# EasyEDA Pro project Amplifier Module A.eprj

# Schematic Schematic1
Create Date: 2024-02-14; Page Name: P1; Project Name: Amplifier Module A; Schematic Name: Schematic1; Update Date: 2024-02-28; Company: EasyEDA.com; Drawn: EasyEDA; Page Size: A4; Part Number: JLCPCB-002; Reviewed: EasyEDA; Version: V0.1
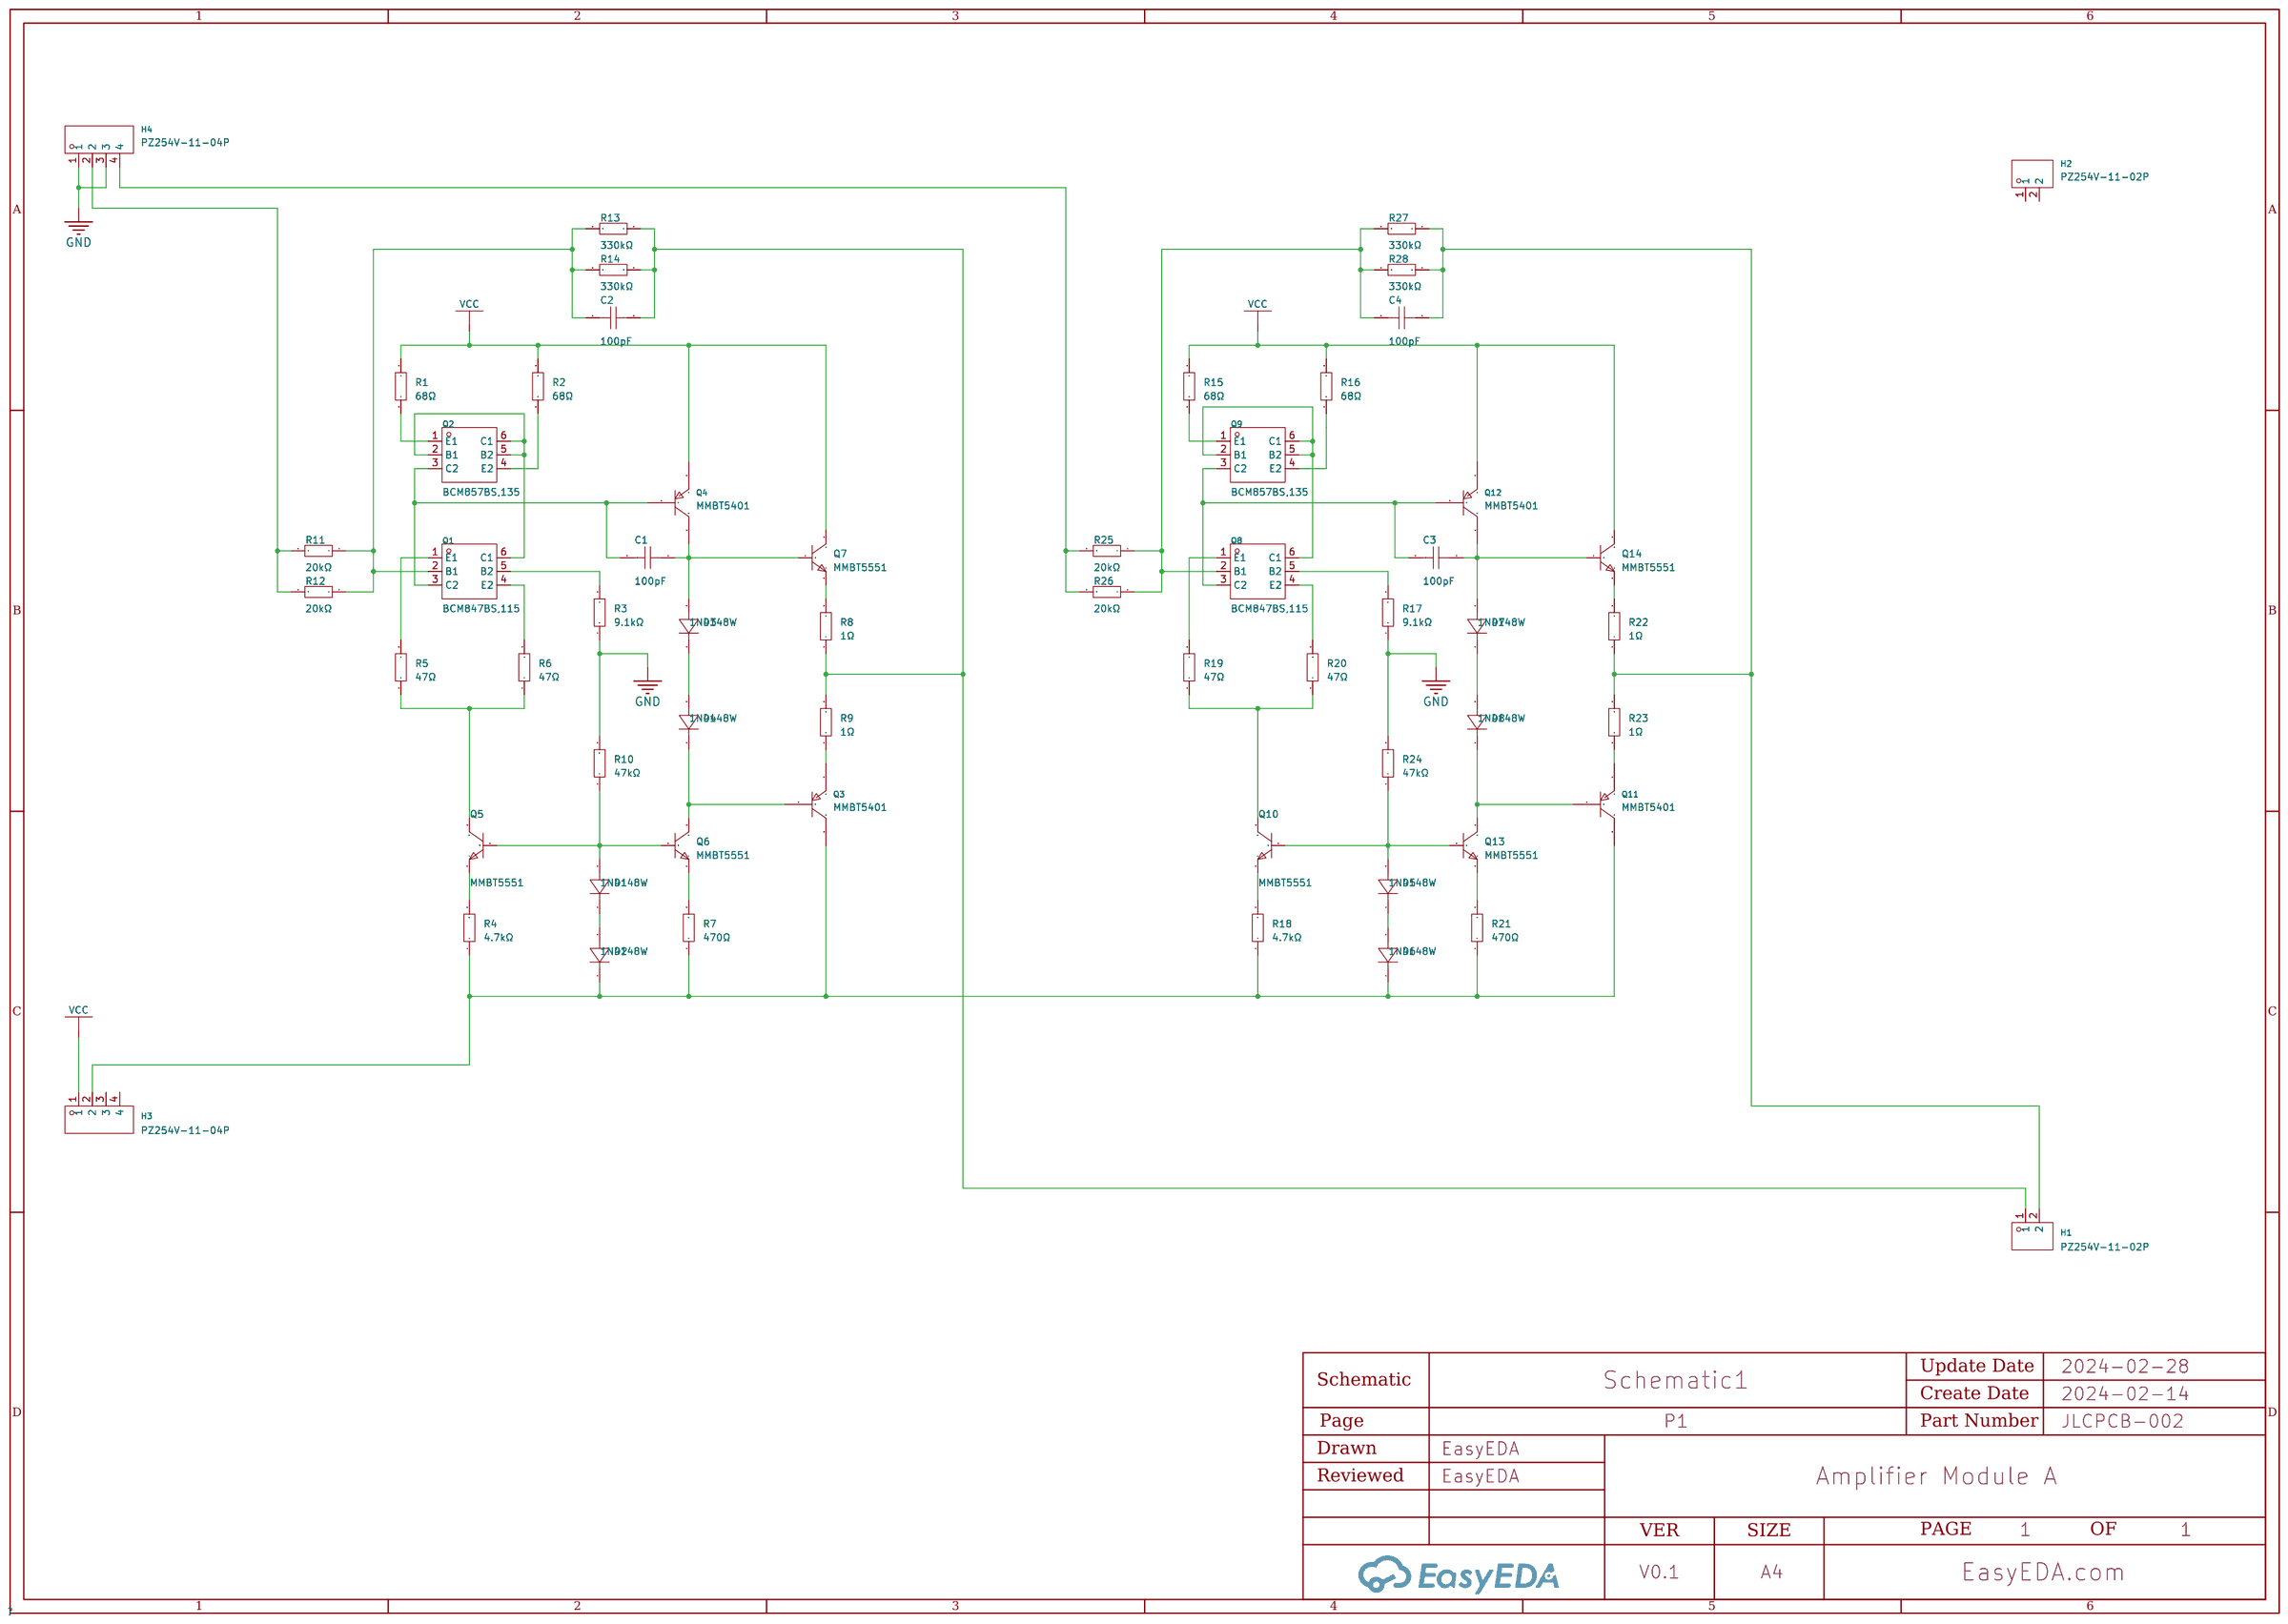
[diagram p0: schematic sheet]

## Parts
C1  100pF  [C0603]
C2  100pF  [C0603]
C3  100pF  [C0603]
C4  100pF  [C0603]
D1  1N4148W  [SOD-123F_L2.7-W1.6-LS3.8-RD]
D2  1N4148W  [SOD-123F_L2.7-W1.6-LS3.8-RD]
D3  1N4148W  [SOD-123F_L2.7-W1.6-LS3.8-RD]
D4  1N4148W  [SOD-123F_L2.7-W1.6-LS3.8-RD]
D5  1N4148W  [SOD-123F_L2.7-W1.6-LS3.8-RD]
D6  1N4148W  [SOD-123F_L2.7-W1.6-LS3.8-RD]
D7  1N4148W  [SOD-123F_L2.7-W1.6-LS3.8-RD]
D8  1N4148W  [SOD-123F_L2.7-W1.6-LS3.8-RD]
H1  PZ254V-11-02P  [HDR-TH_2P-P2.54-V-M]  (no BOM)
H2  PZ254V-11-02P  [HDR-TH_2P-P2.54-V-M]  (no BOM)
H3  PZ254V-11-04P  [HDR-TH_4P-P2.54-V-M]  (no BOM)
H4  PZ254V-11-04P  [HDR-TH_4P-P2.54-V-M]  (no BOM)
Q1  BCM847BS,115  [SOT-363_L2.0-W1.3-P0.65-LS2.1-TL]
Q2  BCM857BS,135  [SOT-363_L2.0-W1.3-P0.65-LS2.1-BL]
Q3  MMBT5401  [SOT-23-3_L2.9-W1.3-P1.90-LS2.4-BR]
Q4  MMBT5401  [SOT-23-3_L2.9-W1.3-P1.90-LS2.4-BR]
Q5  MMBT5551  [SOT-23-3_L2.9-W1.3-P1.90-LS2.4-BR]
Q6  MMBT5551  [SOT-23-3_L2.9-W1.3-P1.90-LS2.4-BR]
Q7  MMBT5551  [SOT-23-3_L2.9-W1.3-P1.90-LS2.4-BR]
Q8  BCM847BS,115  [SOT-363_L2.0-W1.3-P0.65-LS2.1-TL]
Q9  BCM857BS,135  [SOT-363_L2.0-W1.3-P0.65-LS2.1-BL]
Q10  MMBT5551  [SOT-23-3_L2.9-W1.3-P1.90-LS2.4-BR]
Q11  MMBT5401  [SOT-23-3_L2.9-W1.3-P1.90-LS2.4-BR]
Q12  MMBT5401  [SOT-23-3_L2.9-W1.3-P1.90-LS2.4-BR]
Q13  MMBT5551  [SOT-23-3_L2.9-W1.3-P1.90-LS2.4-BR]
Q14  MMBT5551  [SOT-23-3_L2.9-W1.3-P1.90-LS2.4-BR]
R1  68Ω  [R0603]
R2  68Ω  [R0603]
R3  9.1kΩ  [R0603]
R4  4.7kΩ  [R0603]
R5  47Ω  [R0603]
R6  47Ω  [R0603]
R7  470Ω  [R0603]
R8  1Ω  [R0603]
R9  1Ω  [R0603]
R10  47kΩ  [R0603]
R11  20kΩ  [R0603]
R12  20kΩ  [R0603]
R13  330kΩ  [R0603]
R14  330kΩ  [R0603]
R15  68Ω  [R0603]
R16  68Ω  [R0603]
R17  9.1kΩ  [R0603]
R18  4.7kΩ  [R0603]
R19  47Ω  [R0603]
R20  47Ω  [R0603]
R21  470Ω  [R0603]
R22  1Ω  [R0603]
R23  1Ω  [R0603]
R24  47kΩ  [R0603]
R25  20kΩ  [R0603]
R26  20kΩ  [R0603]
R27  330kΩ  [R0603]
R28  330kΩ  [R0603]

## Library data of the parts
C1-C4 = 0603CG101J101NT: Capacitance: Tolerance:±5% Tolerance:±5% Voltage Rated: Temperature Coefficient:; LCSC Part Name: 100pF ±5% 100V; Supplier Part: C44567; Manufacturer: FH(风华); Supplier Footprint: 0603; JLCPCB Part Class: Extended Part; Datasheet: https://atta.szlcsc.com/upload/public/pdf/source/20200305/C486355_26A10D38EF8C2A5C37091D0039909270.pdf; Supplier: LCSC; Tolerance: ±5%
D1-D8 = 1N4148W_C81598: Diode Configuration: Forward Voltage (Vf@If):1V@50mA Reverse Voltage (Vr): Average Rectified Current (Io): Power Dissipation: Reverse Leakage Current:1uA@75V Reverse Recovery Time (trr): Operating Temperature:- Operating Temperature:-; LCSC Part Name: 电压:75V 电流:150mA; Supplier Part: C81598; Manufacturer: ST(先科); Supplier Footprint: SOD-123; JLCPCB Part Class: Basic Part; Datasheet: https://atta.szlcsc.com/upload/public/pdf/source/20161024/1477288446905.pdf; Supplier: LCSC; Forward Voltage (Vf@If): 1V@50mA; Reverse Leakage Current: 1uA@75V
H1 H2 = PZ254V-11-02P: Pin Structure:1x2P Pitch:2.54mm Row Spacing:- Circluar Pins/Square Pins:Square Pins Mounting Type:Straight Number of Rows:Plugin Number of Pins:2P Current Rating (Max):- Voltage Rating (Max):- Length of Mating Pin:6mm Insulation Height:2.5mm Length of End; LCSC Part Name: 间距:2.54mm 1x2P 直插 方针; Supplier Part: C492401; Manufacturer: XFCN(兴飞); Supplier Footprint: 插件,P=2.54mm; JLCPCB Part Class: Extended Part; Datasheet: https://atta.szlcsc.com/upload/public/pdf/source/20200309/C492401_A812433581A9B211A7FFA413ADDFF0E5.pdf; Supplier: LCSC; Pin Structure: 1x2P; Pitch: 2.54mm; Circluar Pins/Square Pins: Square Pins; Mounting Type: Straight; Number of Rows: Plugin; Number of Pins: 2P; Length of Mating Pin: 6mm; Insulation Height: 2.5mm; Length of End Connection Pin: 3mm; Operating Temperature Range: -40℃~+105℃; Color: Black
H3 H4 = PZ254V-11-04P: Pin Structure:1x4P Pitch:2.54mm Row Spacing:- Circluar Pins/Square Pins:Square Pins Mounting Type:Straight Number of Rows:Plugin Number of Pins:4P Current Rating (Max):3A Voltage Rating (Max):250V Length of Mating Pin:6mm Insulation Height:2.5mm Length of; LCSC Part Name: 间距:2.54mm 1x4P 直插 方针; Supplier Part: C2691448; Manufacturer: XFCN(兴飞); Supplier Footprint: 插件,P=2.54mm; JLCPCB Part Class: Extended Part; Datasheet: https://atta.szlcsc.com/upload/public/pdf/source/20200309/C492403_F9F19131791D08044AD4F84F8E751A34.pdf; Supplier: LCSC; Pin Structure: 1x4P; Pitch: 2.54mm; Circluar Pins/Square Pins: Square Pins; Mounting Type: Straight; Number of Rows: Plugin; Number of Pins: 4P; Current Rating (Max): 3A; Voltage Rating (Max): 250V; Length of Mating Pin: 6mm; Insulation Height: 2.5mm; Length of End Connection Pin: 3mm; Operating Temperature Range: -40℃~+105℃; Color: Black
Q1 Q8 = BCM847BS,115: Transistor Type:2 NPN Collector Current (Ic): Collector-Emitter Breakdown Voltage (Vceo): Power Dissipation (Pd): DC Current Gain (hFE@Ic,Vce):200@2mA,5V DC Current Gain (hFE@Ic,Vce):200@2mA,5V Transition Frequency (fT):250MHz Collector Cut-Off Current (I; LCSC Part Name: 耐压:45V 电流:100mA 2个NPN; Supplier Part: C396099; Manufacturer: Nexperia(安世); Supplier Footprint: SOT-363; JLCPCB Part Class: Extended Part; Datasheet: https://atta.szlcsc.com/upload/public/pdf/source/20191121/C458178_4EE31D3B148B127A6331BB364C0F8B2D.pdf; Supplier: LCSC; Transistor Type: 2 NPN; DC Current Gain (hFE@Ic,Vce): 200@2mA,5V; Transition Frequency (fT): 250MHz; Collector Cut-Off Current (Icbo): 15nA; Collector-Emitter Saturation Voltage (VCE(sat)@Ic,Ib): 400mV@5mA,100mA
Q2 Q9 = BCM857BS,135: Transistor Type: Collector Current (Ic): Collector-Emitter Breakdown Voltage (Vceo): Power Dissipation (Pd): DC Current Gain (hFE@Ic,Vce):200@2mA,5V DC Current Gain (hFE@Ic,Vce):200@2mA,5V Transition Frequency (fT):175MHz Collector Cut-Off Current (Icbo):; LCSC Part Name: 2个PNP 电流:100mA 耐压:45V; Supplier Part: C503385; Manufacturer: Nexperia(安世); Supplier Footprint: SOT-363; JLCPCB Part Class: Extended Part; Datasheet: https://atta.szlcsc.com/upload/public/pdf/source/20200107/C105887_86E9989A2C6D7BFD107FE0D2C6B1BB93.pdf; Supplier: LCSC; DC Current Gain (hFE@Ic,Vce): 200@2mA,5V; Transition Frequency (fT): 175MHz; Collector Cut-Off Current (Icbo): 15nA; Collector-Emitter Saturation Voltage (VCE(sat)@Ic,Ib): 200mV@100mA,5mA
Q3 Q4 Q11 Q12 = MMBT5401_C8326: Transistor Type: Collector Current (Ic): Collector-Emitter Breakdown Voltage (Vceo): Power Dissipation (Pd): DC Current Gain (hFE@Ic,Vce):200@10mA,5V DC Current Gain (hFE@Ic,Vce):200@10mA,5V Transition Frequency (fT):100MHz Collector Cut-Off Current (Icbo; LCSC Part Name: PNP 电流:600mA 耐压:150V hfe=200~300; Supplier Part: C8326; Manufacturer: CJ(江苏长电/长晶); Supplier Footprint: SOT-23; JLCPCB Part Class: Basic Part; Datasheet: https://atta.szlcsc.com/upload/public/pdf/source/20140809/1457707213644.pdf; Supplier: LCSC; DC Current Gain (hFE@Ic,Vce): 200@10mA,5V; Transition Frequency (fT): 100MHz; Collector Cut-Off Current (Icbo): 100nA; Collector-Emitter Saturation Voltage (VCE(sat)@Ic,Ib): 500mV@50mA,5mA
Q5-Q7 Q10 Q13 Q14 = MMBT5551_C2145: Transistor Type: Collector Current (Ic): Collector-Emitter Breakdown Voltage (Vceo): Power Dissipation (Pd): DC Current Gain (hFE@Ic,Vce):200@10mA,5V DC Current Gain (hFE@Ic,Vce):200@10mA,5V Transition Frequency (fT):100MHz Collector Cut-Off Current (Icbo; LCSC Part Name: NPN 电流:600mA 耐压:160V hfe=200~300; Supplier Part: C2145; Manufacturer: CJ(江苏长电/长晶); Supplier Footprint: SOT-23; JLCPCB Part Class: Basic Part; Datasheet: https://atta.szlcsc.com/upload/public/pdf/source/20140321/1457707027001.pdf; Supplier: LCSC; DC Current Gain (hFE@Ic,Vce): 200@10mA,5V; Transition Frequency (fT): 100MHz; Collector Cut-Off Current (Icbo): 50nA; Collector-Emitter Saturation Voltage (VCE(sat)@Ic,Ib): 200mV@50mA,5mA
R1 R2 R15 R16 = 0603WAF680JT5E: Type:Thick Film Resistors Resistance:68Ω Tolerance:±1% Tolerance:±1% Power(Watts): Overload Voltage (Max): Temperature Coefficient:±100ppm/℃ Temperature Coefficient:±100ppm/℃ Operating Temperature Range:-55℃~+155℃ Operating Temperature Range:-55℃~+155℃; LCSC Part Name: 68Ω ±1% 100mW 厚膜电阻; Supplier Part: C27592; Manufacturer: UNI-ROYAL(厚声); Supplier Footprint: 0603; JLCPCB Part Class: Extended Part; Datasheet: https://atta.szlcsc.com/upload/public/pdf/source/20200306/C422600_1E6D84923E4A46A82E41ADD87F860B5C.pdf; Supplier: LCSC; Type: Thick Film Resistors; Tolerance: ±1%; Temperature Coefficient: ±100ppm/℃; Operating Temperature Range: -55℃~+155℃
R3 R17 = 0603WAF9101T5E: Type:Thick Film Resistors Resistance:9.1kΩ Tolerance:±1% Tolerance:±1% Power(Watts): Overload Voltage (Max): Temperature Coefficient:±100ppm/℃ Temperature Coefficient:±100ppm/℃ Operating Temperature Range:-55℃~+155℃ Operating Temperature Range:-55℃~+155℃; LCSC Part Name: 9.1kΩ ±1% 100mW 厚膜电阻; Supplier Part: C23260; Manufacturer: UNI-ROYAL(厚声); Supplier Footprint: 0603; JLCPCB Part Class: Basic Part; Datasheet: https://atta.szlcsc.com/upload/public/pdf/source/20200306/C422600_1E6D84923E4A46A82E41ADD87F860B5C.pdf; Supplier: LCSC; Type: Thick Film Resistors; Tolerance: ±1%; Temperature Coefficient: ±100ppm/℃; Operating Temperature Range: -55℃~+155℃
R4 R18 = 0603WAF4701T5E: Type:Thick Film Resistors Resistance:4.7kΩ Tolerance:±1% Tolerance:±1% Power(Watts): Overload Voltage (Max): Temperature Coefficient:±100ppm/℃ Temperature Coefficient:±100ppm/℃ Operating Temperature Range:-55℃~+155℃ Operating Temperature Range:-55℃~+155℃; LCSC Part Name: 4.7kΩ ±1% 100mW 厚膜电阻; Supplier Part: C23162; Manufacturer: UNI-ROYAL(厚声); Supplier Footprint: 0603; JLCPCB Part Class: Basic Part; Datasheet: https://atta.szlcsc.com/upload/public/pdf/source/20200306/C422600_1E6D84923E4A46A82E41ADD87F860B5C.pdf; Supplier: LCSC; Type: Thick Film Resistors; Tolerance: ±1%; Temperature Coefficient: ±100ppm/℃; Operating Temperature Range: -55℃~+155℃
R5 R6 R19 R20 = 0603WAF470JT5E: Type:Thick Film Resistors Resistance:47Ω Tolerance:±1% Tolerance:±1% Power(Watts): Overload Voltage (Max): Temperature Coefficient:±100ppm/℃ Temperature Coefficient:±100ppm/℃ Operating Temperature Range:-55℃~+155℃ Operating Temperature Range:-55℃~+155℃; LCSC Part Name: 47Ω ±1% 100mW 厚膜电阻; Supplier Part: C23182; Manufacturer: UNI-ROYAL(厚声); Supplier Footprint: 0603; JLCPCB Part Class: Basic Part; Datasheet: https://atta.szlcsc.com/upload/public/pdf/source/20200306/C422600_1E6D84923E4A46A82E41ADD87F860B5C.pdf; Supplier: LCSC; Type: Thick Film Resistors; Tolerance: ±1%; Temperature Coefficient: ±100ppm/℃; Operating Temperature Range: -55℃~+155℃
R7 R21 = 0603WAF4700T5E: Type:Thick Film Resistors Resistance: Tolerance:±1% Tolerance:±1% Power(Watts): Overload Voltage (Max): Temperature Coefficient:±100ppm/℃ Temperature Coefficient:±100ppm/℃ Operating Temperature Range:-55℃~+155℃ Operating Temperature Range:-55℃~+155℃; LCSC Part Name: 470Ω ±1% 100mW 厚膜电阻; Supplier Part: C23179; Manufacturer: UNI-ROYAL(厚声); Supplier Footprint: 0603; JLCPCB Part Class: Basic Part; Datasheet: https://atta.szlcsc.com/upload/public/pdf/source/20200306/C422600_1E6D84923E4A46A82E41ADD87F860B5C.pdf; Supplier: LCSC; Type: Thick Film Resistors; Tolerance: ±1%; Temperature Coefficient: ±100ppm/℃; Operating Temperature Range: -55℃~+155℃
R8 R9 R22 R23 = 0603WAF100KT5E: Type:Thick Film Resistors Resistance:1Ω Tolerance:±1% Tolerance:±1% Power(Watts): Overload Voltage (Max): Temperature Coefficient:±400ppm/℃ Temperature Coefficient:±400ppm/℃ Operating Temperature Range:-55℃~+155℃ Operating Temperature Range:-55℃~+155℃; LCSC Part Name: 1Ω ±1% 100mW 厚膜电阻; Supplier Part: C22936; Manufacturer: UNI-ROYAL(厚声); Supplier Footprint: 0603; JLCPCB Part Class: Basic Part; Datasheet: https://atta.szlcsc.com/upload/public/pdf/source/20200306/C422600_1E6D84923E4A46A82E41ADD87F860B5C.pdf; Supplier: LCSC; Type: Thick Film Resistors; Tolerance: ±1%; Temperature Coefficient: ±400ppm/℃; Operating Temperature Range: -55℃~+155℃
R10 R24 = 0603WAF4702T5E: Type:Thick Film Resistors Resistance:47kΩ Tolerance:±1% Tolerance:±1% Power(Watts): Overload Voltage (Max): Temperature Coefficient:±100ppm/℃ Temperature Coefficient:±100ppm/℃ Operating Temperature Range:-55℃~+155℃ Operating Temperature Range:-55℃~+155℃; LCSC Part Name: 47kΩ ±1% 100mW 厚膜电阻; Supplier Part: C25819; Manufacturer: UNI-ROYAL(厚声); Supplier Footprint: 0603; JLCPCB Part Class: Basic Part; Datasheet: https://atta.szlcsc.com/upload/public/pdf/source/20200306/C422600_1E6D84923E4A46A82E41ADD87F860B5C.pdf; Supplier: LCSC; Type: Thick Film Resistors; Tolerance: ±1%; Temperature Coefficient: ±100ppm/℃; Operating Temperature Range: -55℃~+155℃
R11 R12 R25 R26 = 0603WAF2002T5E: Type:Thick Film Resistors Resistance:20kΩ Tolerance:±1% Tolerance:±1% Power(Watts): Overload Voltage (Max): Temperature Coefficient:±100ppm/℃ Temperature Coefficient:±100ppm/℃ Operating Temperature Range:-55℃~+155℃ Operating Temperature Range:-55℃~+155℃; LCSC Part Name: 20kΩ ±1% 100mW 厚膜电阻; Supplier Part: C4184; Manufacturer: UNI-ROYAL(厚声); Supplier Footprint: 0603; JLCPCB Part Class: Basic Part; Datasheet: https://atta.szlcsc.com/upload/public/pdf/source/20200306/C422600_1E6D84923E4A46A82E41ADD87F860B5C.pdf; Supplier: LCSC; Type: Thick Film Resistors; Tolerance: ±1%; Temperature Coefficient: ±100ppm/℃; Operating Temperature Range: -55℃~+155℃
R13 R14 R27 R28 = 0603WAF3303T5E: Type:Thick Film Resistors Resistance:330kΩ Tolerance:±1% Tolerance:±1% Power(Watts): Overload Voltage (Max): Temperature Coefficient:±100ppm/℃ Temperature Coefficient:±100ppm/℃ Operating Temperature Range:-55℃~+155℃ Operating Temperature Range:-55℃~+155℃; LCSC Part Name: 330kΩ ±1% 100mW 厚膜电阻; Supplier Part: C23137; Manufacturer: UNI-ROYAL(厚声); Supplier Footprint: 0603; JLCPCB Part Class: Basic Part; Datasheet: https://atta.szlcsc.com/upload/public/pdf/source/20200306/C422600_1E6D84923E4A46A82E41ADD87F860B5C.pdf; Supplier: LCSC; Type: Thick Film Resistors; Tolerance: ±1%; Temperature Coefficient: ±100ppm/℃; Operating Temperature Range: -55℃~+155℃

## Nets
GND: H4.1 H4.3 R3.1 R10.2 R17.1 R24.2
VCC: H3.1 Q4.2(E) Q7.3(C) Q12.2(E) Q14.3(C) R1.2 R2.2 R15.2 R16.2
$1N352: Q1.5(B2) R3.2
$1N392: Q2.1(E1) R1.1
$1N396: Q2.4(E2) R2.1
$1N943: D3.1(K) D4.2(A)
$1N952: Q5.2(E) R4.2
$1N965: D1.1(K) D2.2(A)
$1N1213: Q7.2(E) R8.2
$1N1219: Q6.2(E) R7.2
$1N1261: Q5.3(C) R5.1 R6.1
$1N1268: Q1.4(E2) R6.2
$1N1272: Q1.1(E1) R5.2
$1N1306: D1.2(A) Q5.1(B) Q6.1(B) R10.1
$1N1603: C2.2 Q1.2(B1) R11.1 R12.1 R13.2 R14.2
$1N4259: H4.2 R11.2 R12.2
$1N6262: Q8.5(B2) R17.2
$1N6263: Q9.1(E1) R15.1
$1N6264: Q9.4(E2) R16.1
$1N6267: D7.1(K) D8.2(A)
$1N6268: Q10.2(E) R18.2
$1N6269: D5.1(K) D6.2(A)
$1N6270: Q14.2(E) R22.2
$1N6271: Q11.2(E) R23.1
$1N6272: Q13.2(E) R21.2
$1N6273: Q10.3(C) R19.1 R20.1
$1N6274: Q8.4(E2) R20.2
$1N6275: Q8.1(E1) R19.2
$1N6276: D5.2(A) Q10.1(B) Q13.1(B) R24.1
$1N6277: C4.2 Q8.2(B1) R25.1 R26.1 R27.2 R28.2
$1N6278: D8.1(K) Q11.1(B) Q13.3(C)
$1N6279: C3.1 D7.2(A) Q12.3(C) Q14.1(B)
$1N6352: C2.1 H1.1 R8.1 R9.2 R13.1 R14.1
$1N6394: H4.4 R25.2 R26.2
$1N6410: C4.1 H1.2 R22.1 R23.2 R27.1 R28.1
$1N11327: Q3.2(E) R9.1
$1N11333: D4.1(K) Q3.1(B) Q6.3(C)
$1N11343: D2.1(K) D6.1(K) H3.2 Q3.3(C) Q11.3(C) R4.1 R7.1 R18.1 R21.1
$1N11425: C1.1 D3.2(A) Q4.3(C) Q7.1(B)
$1N15038: Q8.6(C1) Q9.2(B1) Q9.5(B2) Q9.6(C1)
$1N15063: C3.2 Q8.3(C2) Q9.3(C2) Q12.1(B)
$1N15103: C1.2 Q1.3(C2) Q2.3(C2) Q4.1(B)
$1N15131: Q1.6(C1) Q2.2(B1) Q2.5(B2) Q2.6(C1)

Not connected (* = marked no-connect by the designer): H2 1 2; H3 3 4

# Board PCB1
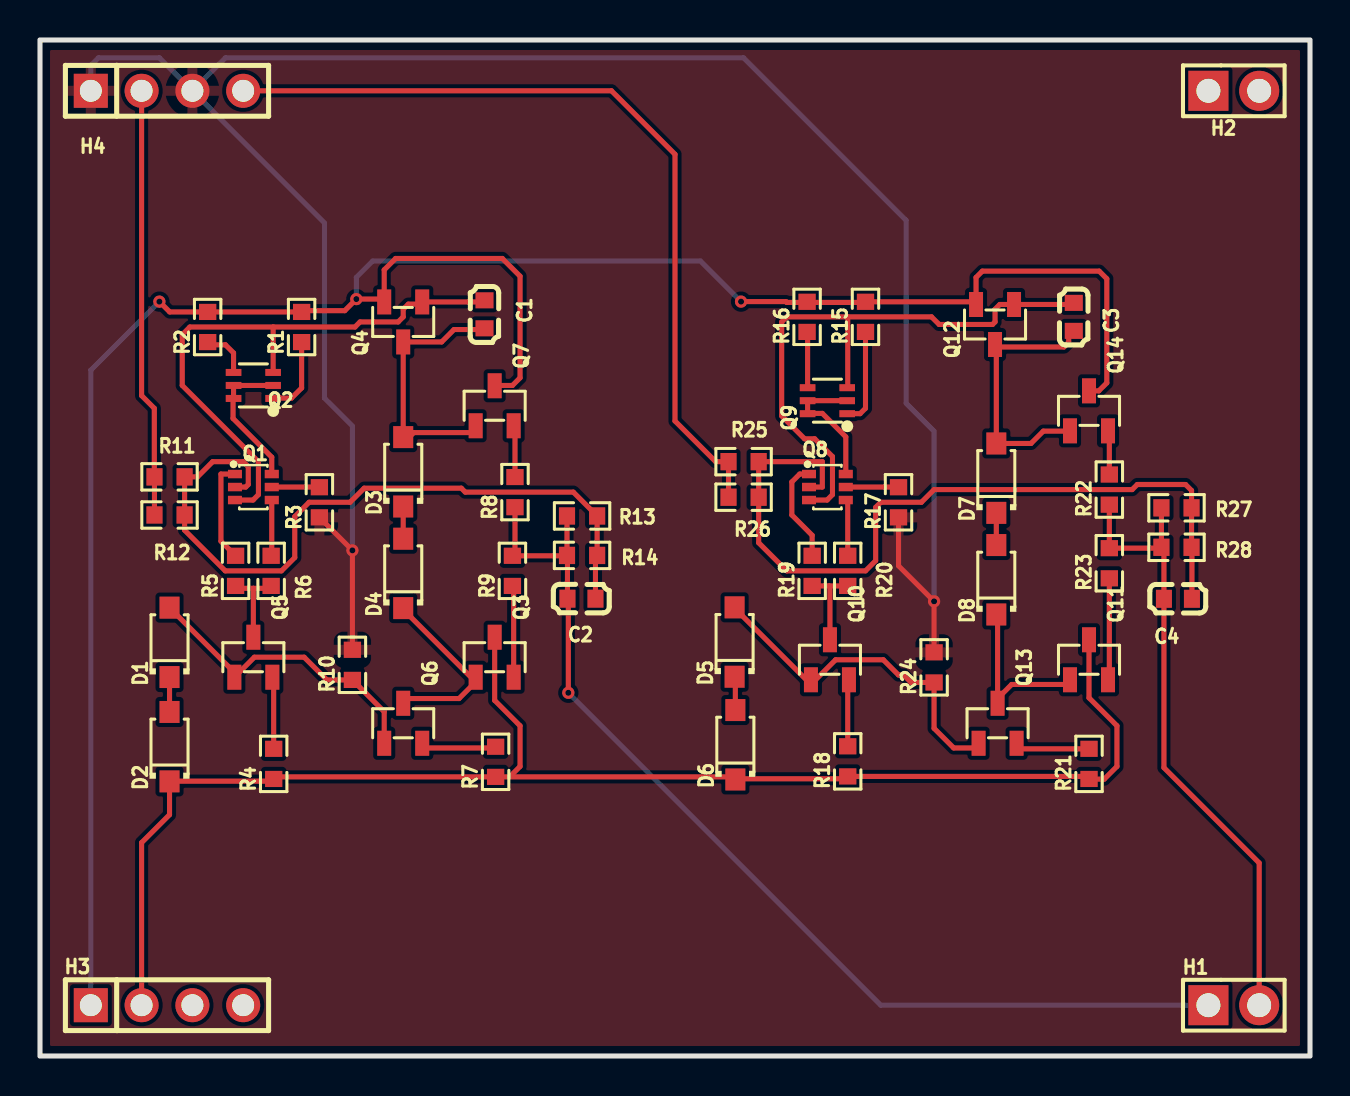
[diagram p1: board, top side]
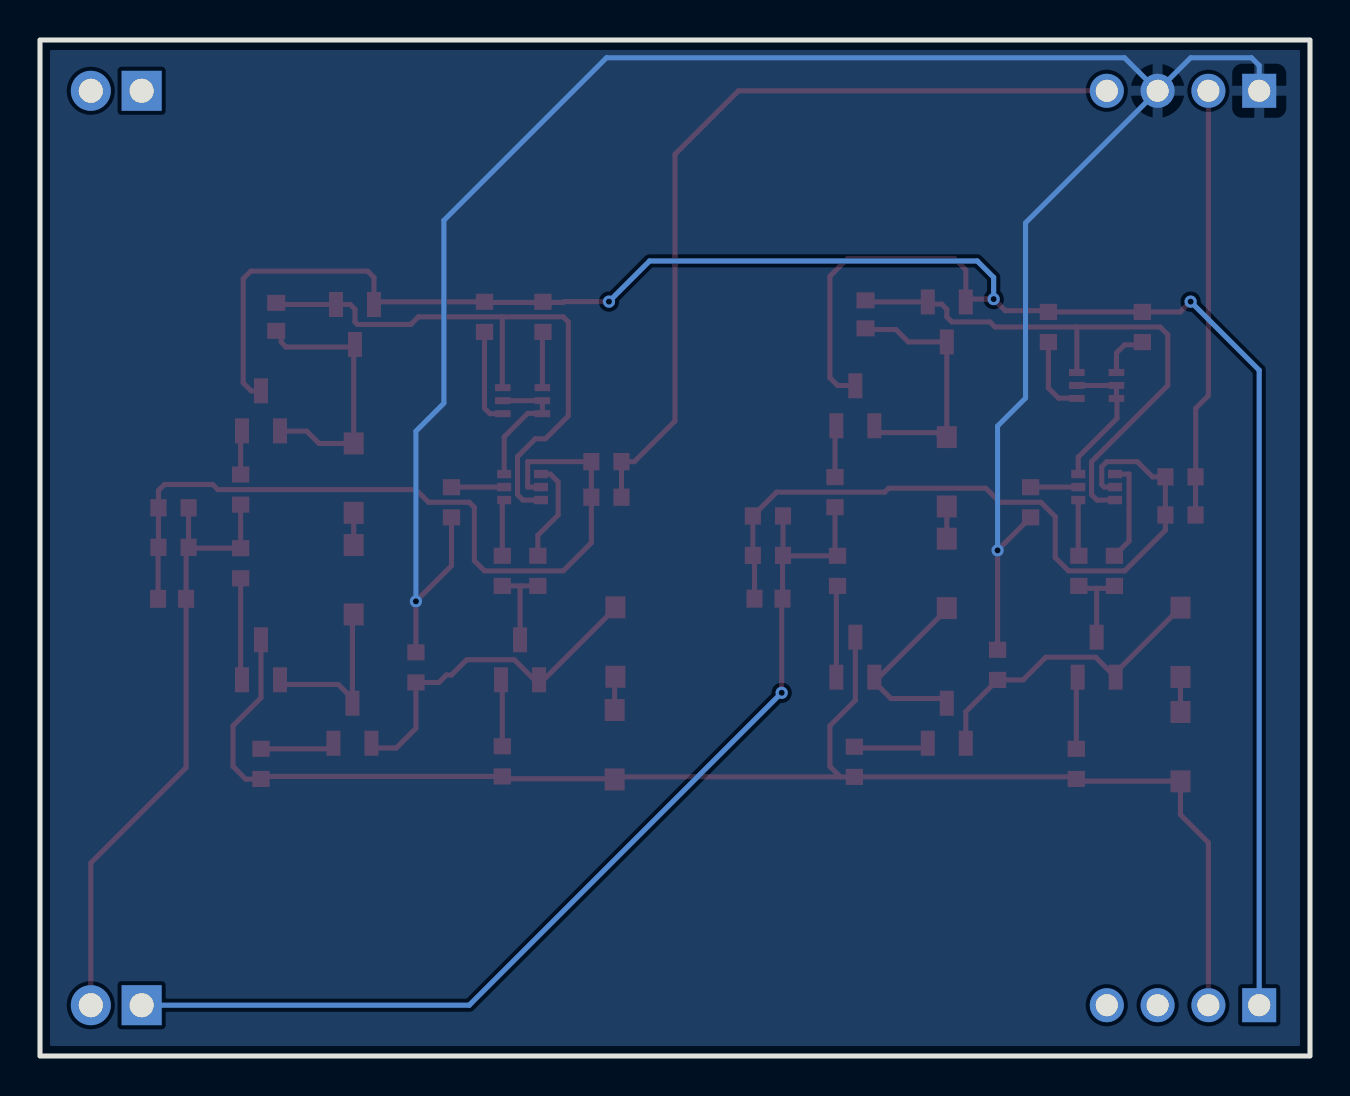
[diagram p2: board, bottom side, seen from below]

Outline 63.5 x 50.8 mm; copper layers: Top Layer, Bottom Layer. Coordinates in mm from the lower left corner of the outline.
Outline path: rectangle 0,50.8 63.5,0
Stack: Top Layer 0.035mm / Dielectric1 1.51mm FR4 er 4.5 / Bottom Layer 0.035mm

## Design rules (mm)
template: JLCPCB Capability(Two Layers Board)
spacing copperThickness1oz (default): track to track 0.102, other pairs 0.152 to 0.3
spacing copperThickness2oz: track to track 0.203, other pairs 0.152 to 0.3
track width copperThickness1oz (default): min 0.127, default 0.254, max 2.54
track width copperThickness2oz: min 0.203, default 0.254, max 2.54
differential pair differentialPair (default): width min 0.127, default 0.254, max 2.54; gap min 0.152, default 0.152
via viaSize (default): diameter min 0.5, default 0.61, max 10; hole min 0.3, default 0.305, max 6.3

## Placement (name value [footprint] x y rotation side)
C1  100pF  [C0603]  22.22 37.08 90 top
C2  100pF  [C0603]  27.07 22.87 0 top
C3  100pF  [C0603]  51.69 36.96 90 top
C4  100pF  [C0603]  56.9 22.86 0 top
D1  1N4148W  [SOD-123F_L2.7-W1.6-LS3.8-RD]  6.48 20.68 90 top
D2  1N4148W  [SOD-123F_L2.7-W1.6-LS3.8-RD]  6.48 15.47 90 top
D3  1N4148W  [SOD-123F_L2.7-W1.6-LS3.8-RD]  18.16 29.21 90 top
D4  1N4148W  [SOD-123F_L2.7-W1.6-LS3.8-RD]  18.16 24.13 90 top
D5  1N4148W  [SOD-123F_L2.7-W1.6-LS3.8-RD]  34.73 20.7 90 top
D6  1N4148W  [SOD-123F_L2.7-W1.6-LS3.8-RD]  34.77 15.56 90 top
D7  1N4148W  [SOD-123F_L2.7-W1.6-LS3.8-RD]  47.82 28.89 90 top
D8  1N4148W  [SOD-123F_L2.7-W1.6-LS3.8-RD]  47.82 23.81 90 top
H1  PZ254V-11-02P  [HDR-TH_2P-P2.54-V-M]  59.69 2.54 0 top
H2  PZ254V-11-02P  [HDR-TH_2P-P2.54-V-M]  59.69 48.26 0 top
H3  PZ254V-11-04P  [HDR-TH_4P-P2.54-V-M]  6.35 2.54 0 top
H4  PZ254V-11-04P  [HDR-TH_4P-P2.54-V-M]  6.35 48.26 0 top
Q1  BCM847BS,115  [SOT-363_L2.0-W1.3-P0.65-LS2.1-TL]  10.67 28.45 0 top
Q2  BCM857BS,135  [SOT-363_L2.0-W1.3-P0.65-LS2.1-BL]  10.67 33.53 90 top
Q3  MMBT5401  [SOT-23-3_L2.9-W1.3-P1.90-LS2.4-BR]  22.73 19.94 270 top
Q4  MMBT5401  [SOT-23-3_L2.9-W1.3-P1.90-LS2.4-BR]  18.16 36.7 90 top
Q5  MMBT5551  [SOT-23-3_L2.9-W1.3-P1.90-LS2.4-BR]  10.67 19.94 270 top
Q6  MMBT5551  [SOT-23-3_L2.9-W1.3-P1.90-LS2.4-BR]  18.16 16.64 270 top
Q7  MMBT5551  [SOT-23-3_L2.9-W1.3-P1.90-LS2.4-BR]  22.73 32.51 270 top
Q8  BCM847BS,115  [SOT-363_L2.0-W1.3-P0.65-LS2.1-TL]  39.37 28.45 0 top
Q9  BCM857BS,135  [SOT-363_L2.0-W1.3-P0.65-LS2.1-BL]  39.37 32.77 90 top
Q10  MMBT5551  [SOT-23-3_L2.9-W1.3-P1.90-LS2.4-BR]  39.5 19.81 270 top
Q11  MMBT5401  [SOT-23-3_L2.9-W1.3-P1.90-LS2.4-BR]  52.45 19.81 270 top
Q12  MMBT5401  [SOT-23-3_L2.9-W1.3-P1.90-LS2.4-BR]  47.75 36.58 90 top
Q13  MMBT5551  [SOT-23-3_L2.9-W1.3-P1.90-LS2.4-BR]  47.88 16.64 270 top
Q14  MMBT5551  [SOT-23-3_L2.9-W1.3-P1.90-LS2.4-BR]  52.45 32.26 270 top
R1  68Ω  [R0603]  13.08 36.45 90 top
R2  68Ω  [R0603]  8.38 36.45 90 top
R3  9.1kΩ  [R0603]  13.97 27.69 90 top
R4  4.7kΩ  [R0603]  11.68 14.61 90 top
R5  47Ω  [R0603]  9.78 24.26 90 top
R6  47Ω  [R0603]  11.56 24.26 90 top
R7  470Ω  [R0603]  22.78 14.71 90 top
R8  1Ω  [R0603]  23.75 28.19 90 top
R9  1Ω  [R0603]  23.62 24.26 90 top
R10  47kΩ  [R0603]  15.62 19.56 90 top
R11  20kΩ  [R0603]  6.48 28.96 180 top
R12  20kΩ  [R0603]  6.48 27.05 180 top
R13  330kΩ  [R0603]  27.1 27 0 top
R14  330kΩ  [R0603]  27.1 25.03 0 top
R15  68Ω  [R0603]  41.28 36.96 90 top
R16  68Ω  [R0603]  38.35 36.96 90 top
R17  9.1kΩ  [R0603]  42.93 27.69 90 top
R18  4.7kΩ  [R0603]  40.39 14.73 90 top
R19  47Ω  [R0603]  38.61 24.26 90 top
R20  47Ω  [R0603]  40.39 24.26 90 top
R21  470Ω  [R0603]  52.45 14.61 90 top
R22  1Ω  [R0603]  53.47 28.32 90 top
R23  1Ω  [R0603]  53.47 24.64 90 top
R24  47kΩ  [R0603]  44.7 19.43 90 top
R25  20kΩ  [R0603]  35.18 29.72 180 top
R26  20kΩ  [R0603]  35.18 27.94 180 top
R27  330kΩ  [R0603]  56.82 27.41 0 top
R28  330kΩ  [R0603]  56.82 25.44 0 top

## Footprints (pads in the part's own frame, mm; a bottom-side part is the same pattern mirrored in y, then rotated)
C0603
  rect 0.8x0.9 smd: 1(-0.7,0) 2(0.7,0)
HDR-TH_2P-P2.54-V-M
  rect 2x2 hole 1.2: 1(-1.27,0)
  round 2 hole 1.2: 2(1.27,0)
HDR-TH_4P-P2.54-V-M
  rect 1.7x1.7 hole 1.1: 1(-3.81,0)
  round 1.7 hole 1.1: 2(-1.27,0) 3(1.27,0) 4(3.81,0)
R0603
  rect 0.806x0.864 smd: 1(-0.753,0) 2(0.753,0)
SOD-123F_L2.7-W1.6-LS3.8-RD
  rect 1.1x1 smd: 1(-1.735,0) 2(1.735,0)
SOT-23-3_L2.9-W1.3-P1.90-LS2.4-BR
  rect 1.25x0.7 smd: 1(1,-0.95) 2(1,0.95) 3(-1,0)
SOT-363_L2.0-W1.3-P0.65-LS2.1-BL
  rect 0.35x0.78 smd: 1(-0.65,-0.99) 2(0,-0.99) 3(0.65,-0.99) 4(0.65,0.99) 5(0,0.99) 6(-0.65,0.99)
SOT-363_L2.0-W1.3-P0.65-LS2.1-TL
  rect 0.7x0.42 smd: 1(-0.92,0.65) 2(-0.92,0) 3(-0.92,-0.65) 4(0.92,-0.65) 5(0.92,0) 6(0.92,0.65)

## Nets
As in the schematic.

Pads without a net: H2 1 2; H3 3 4

## Via types
v1: diameter 0.61, hole 0.305, Top Layer to Bottom Layer, 6 vias

## Routing (per net, layer and track width the routed paths; a pad name or vN(x,y) marks a point on that pad's centre or on a via; arc(x,y) is an arc through that point)
GND: length 107.6
  Top Layer w0.254: R24.2 v1(44.7,22.73) 42.93,24.51 R17.1 ; R3.1 v1(15.62,25.28) R10.2
  Bottom Layer w0.254: v1(44.7,22.73) 44.7,31.24 43.31,32.64 43.31,41.78 35.18,49.91 9.27,49.91 H4.3 ; H4.1 2.54,49.53 2.92,49.91 5.97,49.91 H4.3 ; H4.3 14.22,41.66 14.22,32.89 15.62,31.5 v1(15.62,25.28)
VCC: length 111.7
  Top Layer w0.254: Q7.3 22.75,33.53 23.62,33.53 24,33.91 24,38.99 23.11,39.88 17.78,39.88 17.21,39.31 Q4.2 17.07,37.85 v1(15.82,37.85) 15.24,37.27 13.08,37.27 13.02,37.2 R2.2 6.49,37.2 v1(5.97,37.72) ; v1(35.05,37.72) 37.3,37.72 37.34,37.68 41.24,37.68 R15.2 46.67,37.71 Q12.2 46.8,38.93 47.12,39.24 52.96,39.24 53.34,38.86 53.34,33.66 52.94,33.26 Q14.3
  Bottom Layer w0.254: H3.1 2.54,34.29 v1(5.97,37.72) ; v1(15.82,37.85) 15.82,38.93 16.64,39.75 33.02,39.75 v1(35.05,37.72)
$1N352: length 2.4
  Top Layer w0.254: R3.2 13.96,28.45 Q1.5
$1N392: length 4
  Top Layer w0.254: 13.08,35.76 13.08,33.4 12.57,32.89 11.67,32.89 Q2.1
$1N396: length 2.5
  Top Layer w0.254: Q2.4 9.68,35.15 9.27,35.56 8.52,35.56 R2.1
$1N943: length 1.7
  Top Layer w0.254: 18.16,27.51 18.16,25.83
$1N952: length 3.4
  Top Layer w0.254: 11.62,18.7 11.68,18.64 R4.2
$1N965: length 1.8
  Top Layer w0.254: 6.48,18.98 6.48,17.17
$1N1213: length 2.4
  Top Layer w0.254: 23.68,31.28 23.75,31.21 R8.2
$1N1219: length 3.7
  Top Layer w0.254: 19.11,15.4 22.72,15.4 22.78,15.46
$1N1261: length 4.1
  Top Layer w0.254: 10.67,23.38 11.44,23.38 R6.1 ; 10.67,23.38 9.9,23.38 R5.1 ; 10.67,23.38 10.67,21.17
$1N1268: length 2.8
  Top Layer w0.254: R6.2 11.59,25.04 Q1.4
$1N1272: length 5.1
  Top Layer w0.254: R5.2 9.05,25.74 9.05,29.1 Q1.1
$1N1306: length 15.7
  Top Layer w0.254: D1.2 9.72,19.18 Q5.1 10.72,19.94 13.21,19.94 14.34,18.8 R10.1 17.21,17.21 17.21,15.4
$1N1603: length 37.1
  Top Layer w0.254: Q1.2 10.29,28.45 10.41,28.58 10.41,29.46 10.16,29.72 8.64,29.72 7.87,28.96 R11.1 7.2,28.96 7.23,28.93 R12.1 7.23,26.29 9.26,24.26 12.07,24.26 12.74,24.92 12.74,26.97 13.46,27.69 15.5,27.69 16.21,28.39 21.07,28.39 21.26,28.19 26.66,28.19 R13.2 ; R13.2 27.8,26.95 ; R13.2 R14.2 27.77,24.94 C2.2
$1N4259: length 21.5
  Top Layer w0.254: R12.2 R11.2 5.72,28.96 5.72,32.39 5.08,33.02 H4.2
$1N6262: length 2.6
  Top Layer w0.254: Q8.5 42.92,28.45 R17.2
$1N6263: length 4.8
  Top Layer w0.254: R15.1 41.28,32.39 41.01,32.12 Q9.1
$1N6264: length 2.8
  Top Layer w0.254: R16.1 38.38,36.18 Q9.4
$1N6267: length 1.7
  Top Layer w0.254: 47.82,25.51 47.82,27.19
$1N6268: length 3.1
  Top Layer w0.254: R18.2 40.39,18.52 40.45,18.58
$1N6269: length 1.8
  Top Layer w0.254: 34.77,17.26 34.77,18.96 34.73,19
$1N6270: length 2
  Top Layer w0.254: 53.4,31.02 53.47,30.96 R22.2
$1N6271: length 5.3
  Top Layer w0.254: 53.4,18.58 53.47,18.64 R23.1
$1N6272: length 3.6
  Top Layer w0.254: 48.83,15.4 48.87,15.36 R21.2
$1N6273: length 4.3
  Top Layer w0.254: R20.1 39.45,23.5 ; 39.45,23.5 R19.1 ; 39.45,23.5 39.5,23.46 39.5,21.05
$1N6274: length 2.8
  Top Layer w0.254: R20.2 40.39,27.7 Q8.4
$1N6275: length 5.1
  Top Layer w0.254: Q8.1 37.99,29.1 37.59,28.7 37.59,27.05 38.61,26.03 R19.2
$1N6276: length 17.5
  Top Layer w0.254: 34.73,22.4 34.73,22.39 38.55,18.58 39.78,19.81 42.16,19.81 42.93,19.05 43.18,19.05 43.55,18.68 R24.1 44.7,16.38 45.69,15.4 46.93,15.4
$1N6277: length 40.3
  Top Layer w0.254: C4.2 57.6,25.42 R28.2 R27.2 57.58,28.27 57.28,28.58 54.86,28.58 54.61,28.32 44.7,28.32 44.07,27.69 42.04,27.69 41.78,27.43 41.78,24.77 41.28,24.26 37.34,24.26 35.93,25.66 R26.1 R25.1 39.12,29.72 39.12,28.45 Q8.2
$1N6278: length 8.2
  Top Layer w0.254: 47.82,22.11 47.88,22.05 47.88,17.87 48.58,18.58 51.5,18.58
$1N6279: length 13.1
  Top Layer w0.254: 47.82,35.45 51.2,35.45 51.44,35.69 51.44,36.26 ; 47.82,35.45 47.75,35.45 ; 47.82,35.45 D7.2 49.55,30.63 50.16,31.24 51.49,31.24 Q14.1
$1N6352: length 52.5
  Top Layer w0.254: 23.75,25.01 R9.2 ; 23.75,25.01 R8.1 ; 23.75,25.01 26.33,25.01 R14.1 ; v1(26.42,18.16) 26.42,22.82 26.37,22.87 26.37,25.01 R14.1 ; R14.1 R13.1
  Bottom Layer w0.254: v1(26.42,18.16) 42.04,2.54 H1.1
$1N6394: length 41.5
  Top Layer w0.254: R26.2 R25.2 33.78,29.72 31.75,31.75 31.75,45.08 28.57,48.26 H4.4
$1N6410: length 31.7
  Top Layer w0.254: R28.1 56.03,25.39 R23.2 R22.1 ; R28.1 56.2,25.31 C4.1 56.2,14.42 60.96,9.65 H1.2 ; R28.1 R27.1
$1N11327: length 4.8
  Top Layer w0.254: R9.1 23.68,23.44 23.68,18.7
$1N11333: length 9.2
  Top Layer w0.254: 18.16,17.87 20.95,17.87 21.78,18.7 18.16,22.33 18.16,22.43
$1N11343: length 74.9
  Top Layer w0.254: H3.2 5.08,10.67 6.48,12.06 6.48,13.77 6.5,13.74 11.68,13.74 R4.1 11.79,13.96 R7.1 23.48,13.96 ; 23.48,13.96 34.67,13.96 34.77,13.86 40.27,13.86 R18.1 52.32,13.98 R21.1 52.46,13.84 53.21,13.84 53.85,14.48 53.85,16.51 52.45,17.91 52.45,21.05 ; 23.48,13.96 24,14.48 24,16.51 22.73,17.78 22.73,21.17
$1N11425: length 12.9
  Top Layer w0.254: D3.2 Q4.3 20.08,35.7 20.7,36.32 22.16,36.32 C1.1 ; 18.16,30.91 18.43,30.91 18.69,31.17 21.68,31.17 21.78,31.28
$1N15038: length 6.9
  Top Layer w0.254: Q9.2 Q9.5 Q9.6 38.4,32.13 39.12,32.13 40.29,30.96 Q8.6
$1N15063: length 30.5
  Top Layer w0.254: 40.39,36.96 37.34,36.96 37.08,36.7 37.08,32 38.23,30.86 38.74,30.86 39.62,29.97 39.62,28.07 39.35,27.8 Q8.3 ; 40.39,36.96 40.39,33.44 Q9.3 ; 40.39,36.96 44.58,36.96 44.96,36.58 47.62,36.58 47.75,36.7 47.75,37.34 47.99,37.58 Q12.1 51.61,37.58 C3.2
$1N15103: length 29.2
  Top Layer w0.254: 11.67,36.45 7.49,36.45 7.11,36.07 7.11,33.53 10.92,29.72 10.92,28.07 10.65,27.8 Q1.3 ; 11.67,36.45 15.75,36.45 16,36.7 17.91,36.7 18.16,36.96 18.16,37.34 18.41,37.59 19,37.59 Q4.1 22.14,37.7 C1.2 ; 11.67,36.45 11.66,36.44 Q2.3
$1N15131: length 7.2
  Top Layer w0.254: Q2.2 Q2.5 Q2.6 9.65,32.85 9.65,31.88 11.59,29.94 Q1.6

## Copper pours and planes (outline as drawn; the poured copper is in the pictures)
GND on Top Layer: 0.25,50.55 63.25,50.55 63.25,0.25 0.25,0.25
GND on Bottom Layer: 0.25,50.55 63.25,50.55 63.25,0.25 0.25,0.25
